# Altium schematic sheet main.SchDoc
size A3; SheetNumber: 1; SheetTotal: 3; SPICEModelCacheBFGZZQUN: <root> / <DocumentId>BFGZZQUN</DocumentId> / </root>
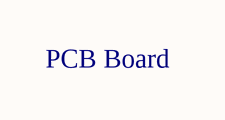
[diagram p0: main.SchDoc]

## Notes on the sheet
- PCB Board